# Altium project DragonFly.PrjPcb
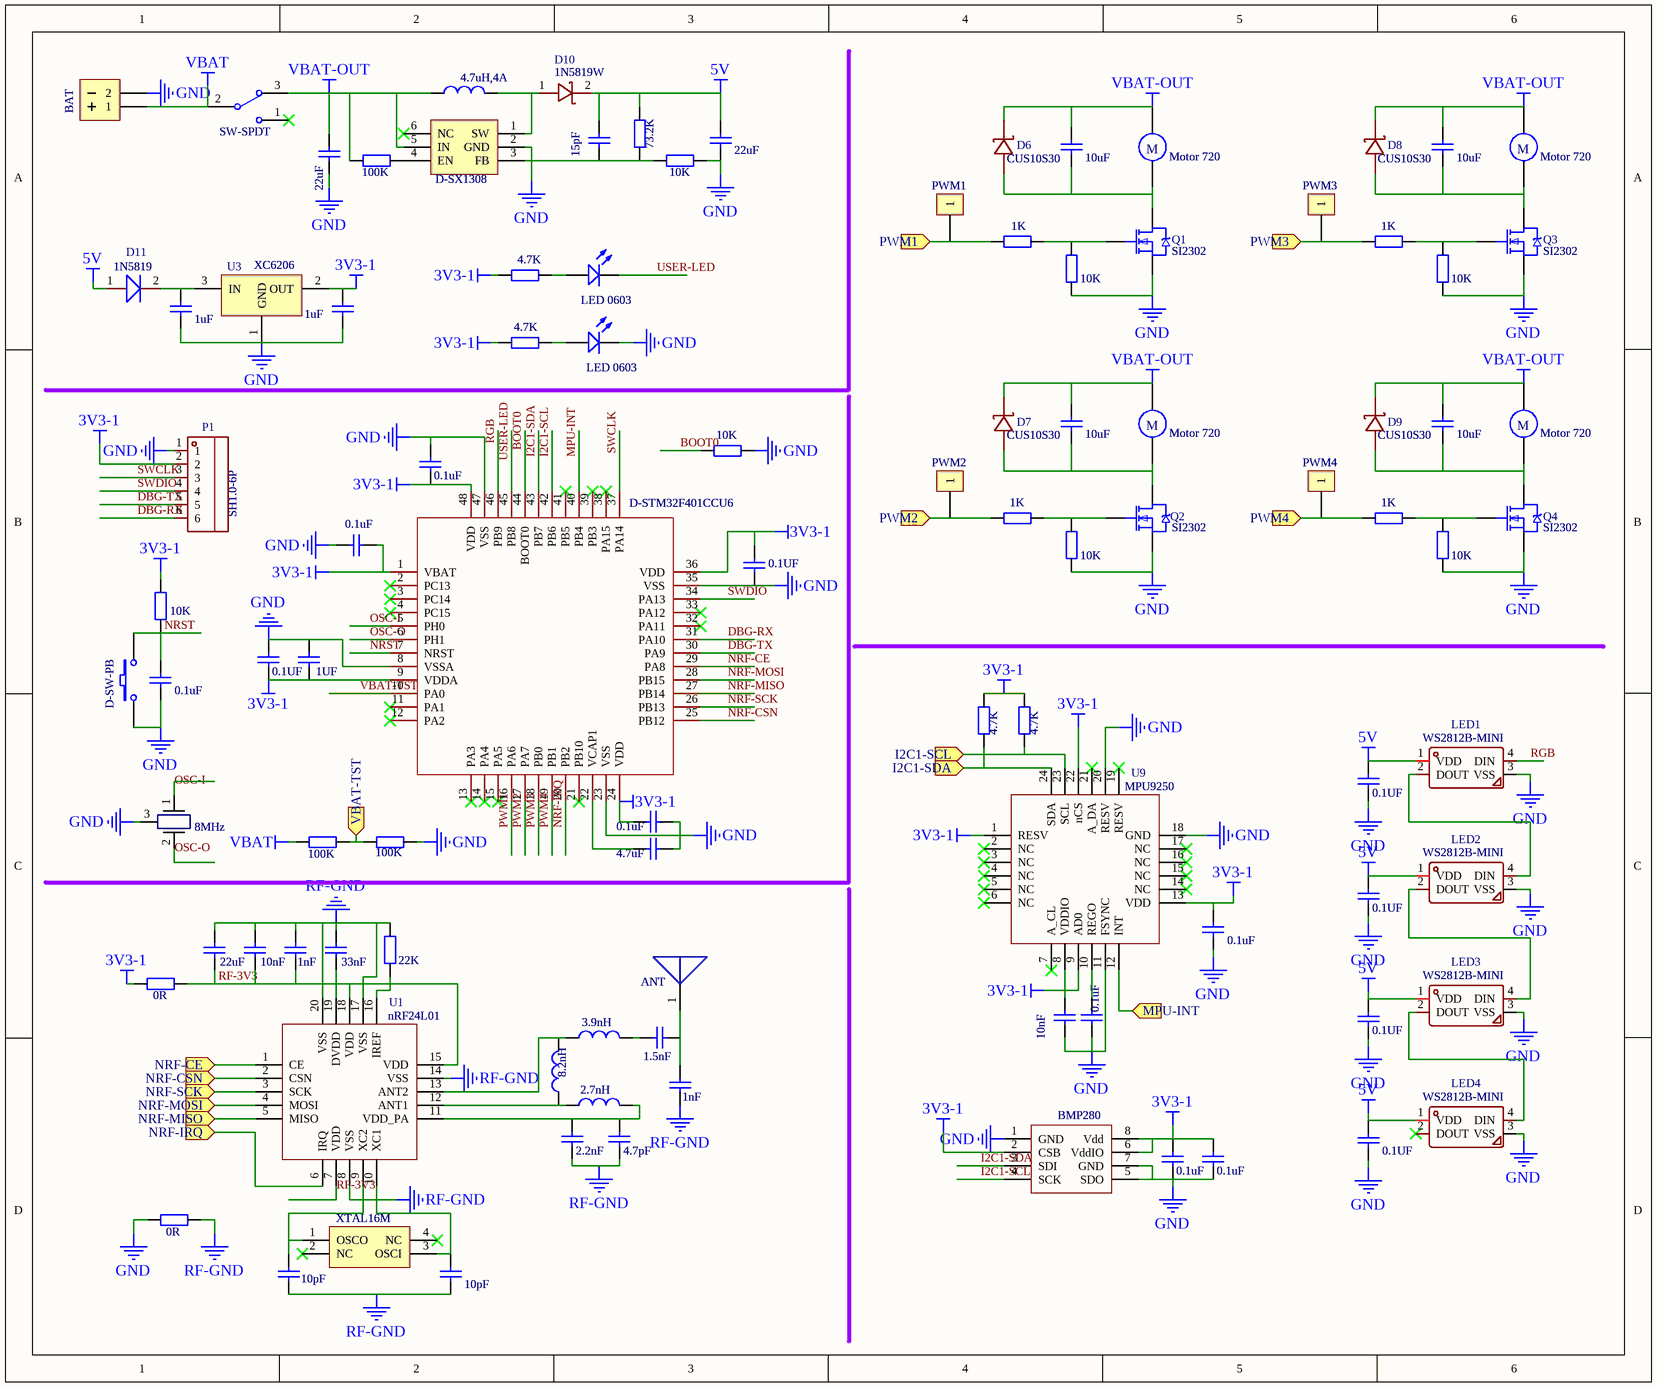
[diagram p0: DragonFly.SchDoc]
1 sheet, 99 parts. Net scope: flat (ports and power ports of the same name join across sheets).
Board file: DragonFly.PcbDoc

## Sheet DragonFly.SchDoc
size 309 x 259 mm

### Parts
(Parts that share a designator on the sheet are numbered #1, #2 ... from top to bottom, then left to right.)
1#1  4.7uH,4A
1#2  BAT
1#3  15pF
1#4  22uF
1#5  10uF
1#6  Motor 720
1#7  10uF
1#8  Motor 720
1#9  22uF
1#10  PWM1
1#11  PWM3
1#12  LED 0603
1#13  1uF
1#14  1uF
1#15  LED 0603
1#16  10uF
1#17  Motor 720
1#18  10uF
1#19  Motor 720
1#20  0.1uF
1#21  PWM2
1#22  PWM4
1#23  0.1uF
1#24  0.1UF
1#25  0.1UF
1#26  1UF
1#27  D-SW-PB
1#28  0.1uF
1#29  0.1UF
1#30  8MHz
1#31  0.1uF
1#32  4.7uF
1#33  0.1UF
1#34  0.1uF
1#35  22uF
1#36  10nF
1#37  1nF
1#38  33nF
1#39  ANT
1#40  10nF
1#41  0.1uF
1#42  0.1UF
1#43  3.9nH
1#44  1.5nF
1#45  8.2nH
1#46  1nF
1#47  2.7nH
1#48  2.2nF
1#49  4.7pF
1#50  0.1UF
1#51  0.1uF
1#52  0.1uF
1#53  10pF
1#54  10pF
2#1  SW-SPDT
2#2  73.2K
2#3  100K
2#4  10K
2#5  1K
2#6  1K
2#7  10K
2#8  10K
2#9  4.7K
2#10  4.7K
2#11  10K
2#12  1K
2#13  1K
2#14  10K
2#15  10K
2#16  10K
2#17  4.7K
2#18  4.7K
2#19  100K
2#20  100K
2#21  22K
2#22  0R
2#23  0R
D6  CUS10S30
D7  CUS10S30
D8  CUS10S30
D9  CUS10S30
D10  1N5819W
D11  1N5819
GND  BMP280
LED1  WS2812B-MINI
LED2  WS2812B-MINI
LED3  WS2812B-MINI
LED4  WS2812B-MINI
OSCO  XTAL16M
P1  SH1.0-6P
Q1  SI2302
Q2  SI2302
Q3  SI2302
Q4  SI2302
SW  D-SX1308
U1  nRF24L01
U3  XC6206
U9  MPU9250
VBAT  D-STM32F401CCU6

### Ports
I2C1-SCL (in), I2C1-SDA (in), MPU-INT (in), NRF-CE (in), NRF-CSN (in), NRF-IRQ (in), NRF-MISO (in), NRF-MOSI (in), NRF-SCK (in), PWM1 (in), PWM2 (in), PWM3 (in), PWM4 (in), VBAT-TST (in)

### Nets
3V3-1: 1#14.1 1#20.1 1#23.1 1#24.2 1#25.1 1#26.1 1#31.2 1#34.2 1#40.1 1#51.2 1#52.2 2#9.1 2#10.1 2#16.1 2#17.2 2#18.2 2#22.1 GND.2(CSB) GND.6(VddIO) GND.8(Vdd) P1.2 U3.2(OUT) U9.1(RESV) U9.8(VDDIO) U9.9(AD0) U9.13(VDD) U9.22(nCS) VBAT.1(VBAT) VBAT.9(VDDA) VBAT.24(VDD) VBAT.36(VDD) VBAT.48(VDD)
5V: 1#3.1 1#4.2 1#29.2 1#33.2 1#42.2 1#50.2 2#2.1 D10.2 D11.1 LED1.1(VDD) LED2.1(VDD) LED3.1(VDD) LED4.1(VDD)
GND: 1#2.2 1#4.1 1#9.2 1#13.2 1#14.2 1#15.2 1#20.2 1#23.2 1#24.1 1#25.2 1#26.2 1#27.1 1#28.1 1#29.1 1#30.3 1#31.1 1#32.1 1#33.1 1#34.1 1#40.2 1#41.1 1#42.1 1#50.1 1#51.1 1#52.1 2#4.1 2#7.1 2#8.1 2#11.2 2#14.1 2#15.1 2#20.2 2#23.1 GND.1(GND) GND.5(SDO) GND.7(GND) LED1.3(VSS) LED2.3(VSS) LED3.3(VSS) LED4.3(VSS) P1.1 Q1.2(S) Q2.2(S) Q3.2(S) Q4.2(S) SW.2(GND) U3.1(GND) U9.11(FSYNC) U9.18(GND) U9.20(RESV) VBAT.8(VSSA) VBAT.23(VSS) VBAT.35(VSS) VBAT.47(VSS)
RF-GND: 1#35.2 1#36.2 1#37.2 1#38.2 1#46.1 1#48.1 1#49.1 1#53.1 1#54.1 2#21.2 2#23.2 U1.8(VSS) U1.14(VSS) U1.17(VSS) U1.20(VSS)
VBAT: 1#2.1 2#1.2 2#19.1
VBAT-OUT: 1#1.1 1#5.2 1#6.1 1#7.2 1#8.1 1#9.1 1#16.2 1#17.1 1#18.2 1#19.1 2#1.3 2#3.2 D6.1(K) D7.1(K) D8.1(K) D9.1(K) SW.5(IN)
BOOT0: 2#11.1 VBAT.44(BOOT0)
DBG-RX: P1.6 VBAT.31(PA10)
DBG-TX: P1.5 VBAT.30(PA9)
I2C1-SCL: GND.4(SCK) VBAT.42(PB6)
I2C1-SDA: GND.3(SDI) VBAT.43(PB7)
MPU-INT: VBAT.40(PB4)
NRF-CE: VBAT.29(PA8)
NRF-CSN: VBAT.25(PB12)
NRF-IRQ: VBAT.20(PB2)
NRF-MISO: VBAT.27(PB14)
NRF-MOSI: VBAT.28(PB15)
NRF-SCK: VBAT.26(PB13)
NRST: 1#27.2 1#28.2 2#16.2 VBAT.7(NRST)
OSC-I: 1#30.1 VBAT.5(PH0)
OSC-O: 1#30.2 VBAT.6(PH1)
PWM1: VBAT.16(PA6)
PWM2: VBAT.17(PA7)
PWM3: VBAT.18(PB0)
PWM4: VBAT.19(PB1)
RF-3V3: 1#35.1 1#36.1 1#37.1 1#38.1 2#22.2 U1.7(VDD) U1.15(VDD) U1.18(VDD) U1.19(DVDD)
RGB: LED1.4(DIN) VBAT.46(PB9)
SWCLK: P1.3 VBAT.37(PA14)
SWDIO: P1.4 VBAT.34(PA13)
USER-LED: 1#12.2 VBAT.45(PB8)
VBAT-TST: VBAT.10(PA0)
Net1#1_2: 1#1.2 D10.1 SW.1(SW)
Net1#3_2: 1#3.2 2#2.2 2#4.2 SW.3(FB)
Net1#5_1: 1#5.1 1#6.2 D6.2(A) Q1.3(D)
Net1#7_1: 1#7.1 1#8.2 D8.2(A) Q3.3(D)
Net1#10_1: 1#10.1 2#5.1 ; port PWM1
Net1#11_1: 1#11.1 2#6.1 ; port PWM3
Net1#12_1: 1#12.1 2#9.2
Net1#13_1: 1#13.1 D11.2 U3.3(IN)
Net1#15_1: 1#15.1 2#10.2
Net1#16_1: 1#16.1 1#17.2 D7.2(A) Q2.3(D)
Net1#18_1: 1#18.1 1#19.2 D9.2(A) Q4.3(D)
Net1#21_1: 1#21.1 2#12.1 ; port PWM2
Net1#22_1: 1#22.1 2#13.1 ; port PWM4
Net1#32_2: 1#32.2 VBAT.22(VCAP1)
Net1#39_1: 1#39.1 1#44.1 1#46.2
Net1#41_2: 1#41.2 U9.10(REGO)
Net1#43_1: 1#43.1 1#45.2 U1.13(ANT2)
Net1#43_2: 1#43.2 1#44.2
Net1#45_1: 1#45.1 1#47.1 U1.12(ANT1)
Net1#47_2: 1#47.2 1#48.2 1#49.2 U1.11(VDD_PA)
Net1#53_2: 1#53.2 OSCO.1(OSCO) U1.9(XC2)
Net1#54_2: 1#54.2 OSCO.3(OSCI) U1.10(XC1)
Net2#3_1: 2#3.1 SW.4(EN)
Net2#5_2: 2#5.2 2#7.2 Q1.1(G)
Net2#6_2: 2#6.2 2#8.2 Q3.1(G)
Net2#12_2: 2#12.2 2#14.2 Q2.1(G)
Net2#13_2: 2#13.2 2#15.2 Q4.1(G)
Net2#17_1: 2#17.1 U9.24(SDA) ; port I2C1-SDA
Net2#18_1: 2#18.1 U9.23(SCL) ; port I2C1-SCL
Net2#19_2: 2#19.2 2#20.1 ; port VBAT-TST
Net2#21_1: 2#21.1 U1.16(IREF)
NetLED1_2: LED1.2(DOUT) LED2.4(DIN)
NetLED2_2: LED2.2(DOUT) LED3.4(DIN)
NetLED3_2: LED3.2(DOUT) LED4.4(DIN)
NetU1_1: U1.1(CE) ; port NRF-CE
NetU1_2: U1.2(CSN) ; port NRF-CSN
NetU1_3: U1.3(SCK) ; port NRF-SCK
NetU1_4: U1.4(MOSI) ; port NRF-MOSI
NetU1_5: U1.5(MISO) ; port NRF-MISO
NetU1_6: U1.6(IRQ) ; port NRF-IRQ
NetU9_12: U9.12(INT) ; port MPU-INT

Not connected (* = marked no-connect by the designer): 2#1 1*; LED4 2(DOUT)*; OSCO 2(NC)* 4(NC)*; SW 6(NC)*; U9 2(NC)* 3(NC)* 4(NC)* 5(NC)* 6(NC)* 7(A_CL)* 14(NC)* 15(NC)* 16(NC)* 17(NC)* 19(RESV)* 21(A_DA)*; VBAT 2(PC13)* 3(PC14)* 4(PC15)* 11(PA1)* 12(PA2)* 13(PA3)* 14(PA4)* 15(PA5)* 21(PB10)* 32(PA11)* 33(PA12)* 38(PA15)* 39(PB3)* 41(PB5)*

### Notes on the sheet
- (in symbol Motor 720) M

### Library data of the parts
1#1 = 4.7uH,4A: Convert to PCB: yes; Origin Footprint: D-L1812-1; Symbol: 4.7uH,4A; Name: 4.7uH,4A; Device: 4.7uH,4A; Add into BOM: yes
1#2 = BAT: Convert to PCB: yes; Origin Footprint: D-BAT; Symbol: BAT; Name: BAT; Device: BAT; Add into BOM: yes
1#3 = 15pF: Convert to PCB: yes; Origin Footprint: C 0402; Symbol: 15pF; Name: 15pF; Device: 15pF; Add into BOM: yes
1#4 1#9 1#35 = 22uF: Convert to PCB: yes; Origin Footprint: D-C 0603; Symbol: 22uF; Name: 22uF; Device: 22uF; Add into BOM: yes
1#5 1#7 1#16 1#18 = 10uF: Convert to PCB: yes; Origin Footprint: D-C 0603; Symbol: 10uF; Name: 10uF; Device: 10uF; Add into BOM: yes
1#6 1#8 1#17 1#19 = Motor 720: Convert to PCB: yes; Origin Footprint: D-MOTOR; Symbol: Motor 720; Name: Motor 720; Device: Motor 720; Add into BOM: yes
1#10 = PWM1: Convert to PCB: yes; Origin Footprint: D-HDR1X1; Symbol: PWM1; Name: PWM1; Device: PWM1; Add into BOM: yes
1#11 = PWM3: Convert to PCB: yes; Origin Footprint: D-HDR1X1; Symbol: PWM3; Name: PWM3; Device: PWM3; Add into BOM: yes
1#12 1#15 = LED 0603: Convert to PCB: yes; Origin Footprint: D-LED-0603; Symbol: LED 0603; Name: LED 0603; Device: LED 0603; Add into BOM: yes
1#13 1#14 = 1uF: Convert to PCB: yes; Origin Footprint: C 0402; Symbol: 1uF; Name: 1uF; Device: 1uF; Add into BOM: yes
1#20 1#23 1#28 1#31 1#34 1#41 1#51 1#52 = 0.1uF: Convert to PCB: yes; Origin Footprint: C 0402; Symbol: 0.1uF; Name: 0.1uF; Device: 0.1uF; Add into BOM: yes
1#21 = PWM2: Convert to PCB: yes; Origin Footprint: D-HDR1X1; Symbol: PWM2; Name: PWM2; Device: PWM2; Add into BOM: yes
1#22 = PWM4: Convert to PCB: yes; Origin Footprint: D-HDR1X1; Symbol: PWM4; Name: PWM4; Device: PWM4; Add into BOM: yes
1#24 1#25 1#29 1#33 1#42 1#50 = 0.1UF: Convert to PCB: yes; Origin Footprint: C 0402; Symbol: 0.1UF; Name: 0.1UF; Device: 0.1UF; Add into BOM: yes
1#26 = 1UF: Convert to PCB: yes; Origin Footprint: C 0402; Symbol: 1UF; Name: 1UF; Device: 1UF; Add into BOM: yes
1#27 = D-SW-PB: Convert to PCB: yes; Origin Footprint: D-SWITCH CEWO; Symbol: D-SW-PB; Name: D-SW-PB; Device: D-SW-PB; Add into BOM: yes
1#30 = 8MHz: Convert to PCB: yes; Origin Footprint: D-SMD-CSTSE800G52-R0; Symbol: 8MHz; Name: 8MHz; Device: 8MHz; Add into BOM: yes
1#32 = 4.7uF: Convert to PCB: yes; Origin Footprint: C 0402; Symbol: 4.7uF; Name: 4.7uF; Device: 4.7uF; Add into BOM: yes
1#36 = 10nF: Convert to PCB: yes; Origin Footprint: D-C 0402; Symbol: 10nF; Name: 10nF; Device: 10nF; Add into BOM: yes
1#37 1#46 = 1nF: Convert to PCB: yes; Origin Footprint: D-C 0402; Symbol: 1nF; Name: 1nF; Device: 1nF; Add into BOM: yes
1#38 = 33nF: Convert to PCB: yes; Origin Footprint: D-C 0402; Symbol: 33nF; Name: 33nF; Device: 33nF; Add into BOM: yes
1#39 = ANT: 封装: R 1206; Convert to PCB: yes; Origin Footprint: D-ANT; Symbol: ANT; Name: ANT; Device: ANT; Add into BOM: yes
1#40 = 10nF: Convert to PCB: yes; Origin Footprint: C 0402; Symbol: 10nF; Name: 10nF; Device: 10nF; Add into BOM: yes
1#43 = 3.9nH: Convert to PCB: yes; Origin Footprint: D-L0402; Symbol: 3.9nH; Name: 3.9nH; Device: 3.9nH; Add into BOM: yes
1#44 = 1.5nF: Convert to PCB: yes; Origin Footprint: D-C 0402; Symbol: 1.5nF; Name: 1.5nF; Device: 1.5nF; Add into BOM: yes
1#45 = 8.2nH: Convert to PCB: yes; Origin Footprint: D-L0402; Symbol: 8.2nH; Name: 8.2nH; Device: 8.2nH; Add into BOM: yes
1#47 = 2.7nH: Convert to PCB: yes; Origin Footprint: D-L0402; Symbol: 2.7nH; Name: 2.7nH; Device: 2.7nH; Add into BOM: yes
1#48 = 2.2nF: Convert to PCB: yes; Origin Footprint: D-C 0402; Symbol: 2.2nF; Name: 2.2nF; Device: 2.2nF; Add into BOM: yes
1#49 = 4.7pF: Convert to PCB: yes; Origin Footprint: D-C 0402; Symbol: 4.7pF; Name: 4.7pF; Device: 4.7pF; Add into BOM: yes
1#53 1#54 = 10pF: Convert to PCB: yes; Origin Footprint: D-C 0402; Symbol: 10pF; Name: 10pF; Device: 10pF; Add into BOM: yes
2#1 = SW-SPDT: Convert to PCB: yes; Origin Footprint: D-SWITCH PWR; Symbol: SW-SPDT; Name: SW-SPDT; Device: SW-SPDT; Add into BOM: yes
2#2 = 73.2K: Convert to PCB: yes; Origin Footprint: R 0402; Symbol: 73.2K; Name: 73.2K; Device: 73.2K; Add into BOM: yes
2#3 2#19 2#20 = 100K: Convert to PCB: yes; Origin Footprint: R 0402; Symbol: 100K; Name: 100K; Device: 100K; Add into BOM: yes
2#4 2#7 2#8 2#11 2#14-2#16 = 10K: Convert to PCB: yes; Origin Footprint: R 0402; Symbol: 10K; Name: 10K; Device: 10K; Add into BOM: yes
2#5 2#6 2#12 2#13 = 1K: Convert to PCB: yes; Origin Footprint: R 0402; Symbol: 1K; Name: 1K; Device: 1K; Add into BOM: yes
2#9 2#10 2#17 2#18 = 4.7K: Convert to PCB: yes; Origin Footprint: R 0402; Symbol: 4.7K; Name: 4.7K; Device: 4.7K; Add into BOM: yes
2#21 = 22K: Convert to PCB: yes; Origin Footprint: D-R 0402; Symbol: 22K; Name: 22K; Device: 22K; Add into BOM: yes
2#22 2#23 = 0R: Convert to PCB: yes; Origin Footprint: D-R 0603; Symbol: 0R; Name: 0R; Device: 0R; Add into BOM: yes
D6-D9 = CUS10S30: Manufacturer: TOSHIBA; Manufacturer Part: CUS10S30 H3F; Convert to PCB: yes; Origin Footprint: SOD-323; Symbol: CUS10S30; Name: CUS10S30; Device: CUS10S30; Supplier: LCSC; Supplier Part: C146335; JLCPCB Part Class: Extend; Add into BOM: yes
D10 = 1N5819W: Manufacturer: Shandong Jingdao Microelectronics; Convert to PCB: yes; Origin Footprint: R-SOD 123; Symbol: 1N5819W; Name: 1N5819W; Device: 1N5819W; Supplier: LCSC; Supplier Part: C169540; Manufacturer Part: 1N5819W; JLCPCB Part Class: Extend; Add into BOM: yes
D11 = 1N5819: Convert to PCB: yes; Origin Footprint: R-SOD 123; Symbol: 1N5819; Name: 1N5819; Device: 1N5819; Add into BOM: yes
GND = BMP280: Convert to PCB: yes; Origin Footprint: D-LGA-2 5X2MM; Symbol: BMP280; Name: BMP280; Device: BMP280; Add into BOM: yes
LED1-LED4 = WS2812B-MINI: Manufacturer: Worldsemi; Convert to PCB: yes; Symbol: WS2812B-MINI; Name: WS2812B-MINI; Device: WS2812B-MINI; Supplier: LCSC; Manufacturer Part: WS2812B-MINI; Supplier Part: C473063; Add into BOM: yes; Origin Footprint: WS2812B- MINI
OSCO = XTAL16M: Convert to PCB: yes; Origin Footprint: D-SMD-3225 4P; Symbol: XTAL16M; Name: XTAL16M; Device: XTAL16M; Add into BOM: yes
P1 = SH1.0-6P: Manufacturer: JS(钜硕电子); Manufacturer Part: AFC10-S06QCA-00; Convert to PCB: yes; Origin Footprint: CONN-SMD SH1.0-6P; Symbol: SH1.0-6P; Name: SH1.0-6P; Device: SH1.0-6P; Supplier: LCSC; Supplier Part: C2764185; JLCPCB Part Class: Extended Part; Add into BOM: yes
Q1-Q4 = SI2302: Convert to PCB: yes; Origin Footprint: SOT-23-3; Symbol: SI2302; Name: SI2302; Device: SI2302; Published: 8-August-2017; PackageReference: SOT23-3; Publisher: mazhongwei; Add into BOM: yes
SW = D-SX1308: Convert to PCB: yes; Origin Footprint: D-SOT23-6; Symbol: D-SX1308; Name: D-SX1308; Device: D-SX1308; Add into BOM: yes
U1 = nRF24L01: Convert to PCB: yes; Origin Footprint: D-QFN20; Symbol: nRF24L01; Name: nRF24L01; Device: nRF24L01; Add into BOM: yes
U3 = XC6206: Convert to PCB: yes; Origin Footprint: SOT-23-3; Symbol: XC6206; Name: XC6206; Device: XC6206; Add into BOM: yes
U9 = MPU9250: Convert to PCB: yes; Origin Footprint: QFN-24 P0.40; Symbol: MPU9250; Name: MPU9250; Device: MPU9250; Add into BOM: yes
VBAT = D-STM32F401CCU6: Convert to PCB: yes; Origin Footprint: D-QFN48; Symbol: D-STM32F401CCU6; Name: D-STM32F401CCU6; Device: D-STM32F401CCU6; Add into BOM: yes